# Altium schematic sheet 1_InputPowerProtection.SchDoc
size A4; PageSetup: Record=PageOptions|CenterHorizontal=True|CenterVertical=True|PrintScale=1.00|XCorrection=1.00|YCorrection=1.00|PrintKind=1|BorderSize=5000000|LeftOffset=0|BottomOffset=0|Orientation=2|PaperLength=1000|PaperWidth=1000|Scale=100|PaperSource=7|PrintQuality=-3|MediaType=1|DitherType=10|PrintScaleMode=1|PaperKind=Executive|PaperIndex=7
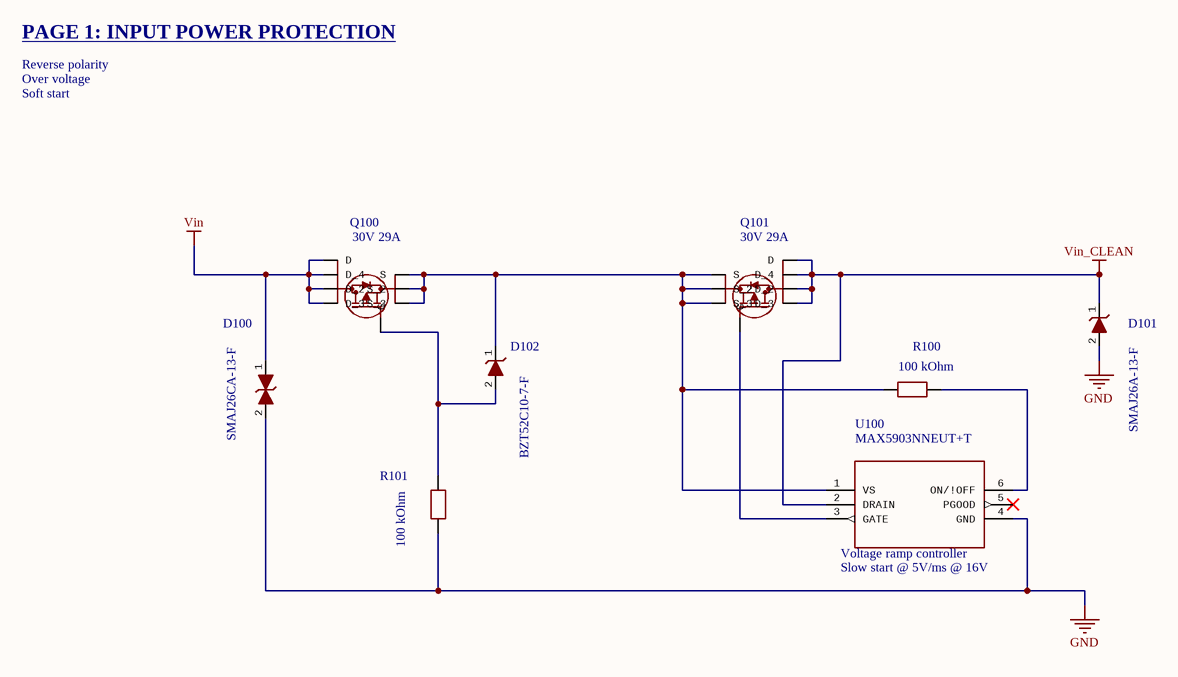
[diagram p0: 1_InputPowerProtection.SchDoc]

## Parts
D100  SMAJ26CA-13-F  [DIODE_DO-214AC]
D101  SMAJ26A-13-F  [DIODE_DO-214AC]
D102  BZT52C10-7-F  [DIODE_SOD-123]
Q100  value 30V 29A  [MOSFET_SOIC-8]  (hidden comment: SI4459ADY)
Q101  value 30V 29A  [MOSFET_SOIC-8]  (hidden comment: SI4459ADY)
R100  value 100 kOhm  [RES_0603]  (hidden comment: ERJ3GEYJ104V)
R101  value 100 kOhm  [RES_0603]  (hidden comment: ERJ3GEYJ104V)
U100  MAX5903NNEUT+T  [HOTSWAP_SOT-6]

## Nets
GND: D100.2 D101.2 R101.1 U100.4(GND)
Vin: D100.1 Q100.5(D_3) Q100.6(D_2) Q100.7(D_4) Q100.8(D)
Vin_CLEAN: D101.1 Q101.5(D_3) Q101.6(D_2) Q101.7(D_4) Q101.8(D) U100.2(DRAIN)
NetD102_1: D102.1 Q100.1(S_3) Q100.2(S_2) Q100.3(S) Q101.1(S_3) Q101.2(S_2) Q101.3(S) R100.1 U100.1(VS)
NetD102_2: D102.2 Q100.4(G) R101.2
NetQ101_4: Q101.4(G) U100.3(GATE)
NetR100_2: R100.2 U100.6(ON/!OFF)

Not connected (* = marked no-connect by the designer): U100 5(PGOOD)*

## Notes on the sheet
- PAGE 1: INPUT POWER PROTECTION
- Reverse polarity
- Over voltage
- Soft start
- (near U100) Voltage ramp controller
- (near U100) Slow start @ 5V/ms @ 16V

## Library data of the parts
D100 = SMAJ26CA-13-F: Diode TVS Bidirectional 26V; Mfr_Name: Diodes Inc; Manufacturer_Part_Number: SMAJ26A-13-F; Value: 26V; Link: https://www.digikey.ca/en/products/detail/diodes-incorporated/SMAJ26A-13-F/806555?s=N4IgTCBcDaIMoFkCCApMA2JBaAYgEQEkAVAJSwDk8QBdAXyA; Package: DO-214AC; PartNumber: SMAJ26CA-13-F; SupplierPartNumber: SMAJ26CA-FDITR-ND; SuppliersPartNumber: C134976
D101 = SMAJ26A-13-F: Diode TVS 26V; Mfr_Name: Diodes Inc; GateName_1: A; DeviceName: SMA_DIO; SymbolName_1: DIODE; LibraryName: 2022-09-06_21-11-13_Library; DeviceSetName: SMAJ26A-13-F; Copyright: Copyright (C) 2022 Ultra Librarian. All rights reserved.; Manufacturer_Part_Number: SMAJ26A-13-F; Digi-Key_Part_Number_1: SMAJ26A-FDICT-ND; Digi-Key_Part_Number_2: SMAJ26A-FDIDKR-ND; Digi-Key_Part_Number_3: SMAJ26A-FDITR-ND; Link: https://www.digikey.ca/en/products/detail/diodes-incorporated/SMAJ26A-13-F/806555?s=N4IgTCBcDaIMoFkCCApMA2JBaAjAZiwDEQBdAXyA; Package: DO-214AC; PartNumber: SMAJ26A-13-F; SupplierPartNumber: SMAJ26A-FDITR-ND; SuppliersPartNumber: C134975
D102 = BZT52C10-7-F: Diode Zener 10V 370mW; Manufacturer_Name: Diodes Inc.; SymbolName_1: BZT52C10-7-F; LibraryName: BZT52C10-7-F; DeviceSetName: BZT52C10-7-F; Manufacturer_Part_Number: BZT52C10-7-F; Mouser_Part_Number: 621-BZT52C10-F; Mouser_Price-Stock: https://www.mouser.co.uk/ProductDetail/Diodes-Incorporated/BZT52C10-7-F?qs=%2F0USrAtie8G0fxvqWmtHrQ%3D%3D; Link: https://www.digikey.ca/en/products/detail/diodes-incorporated/BZT52C10-7-F/717726; Value: 10V 370mW; Package: SOD-123; PartNumber: BZT52C10-7-F; SupplierPartNumber: BZT52C10-FDITR-ND; SuppliersPartNumber: C155227
Q100 Q101 = SI4459ADY-T1-GE3SO_ADY-T1-GE3_VIS-M: P-Channel 30V 29A 5mOHm; Mfr_Name: Vishay; Manufacturer_Part_Number: SI4459ADY-T1-GE3; Link: https://www.digikey.ca/en/products/detail/vishay-siliconix/SI4459ADY-T1-GE3/1978849?s=N4IgTCBcDaIMoEkAsSCsBOAggEQJoFoAVARnwHEBRAZhAF0BfIA; Package: SOIC-8; PartNumber: SI4459ADY-T1-GE3; SupplierNumber: SI4459ADY-T1-GE3TR-ND; SuppliersPartNumber: C143743
R100 R101 = ERJ3GEYJ104V: Res 100kOhm 1/10W 0603; Manufacturer_Name: Panasonic; Link: https://www.digikey.ca/en/products/detail/panasonic-electronic-components/ERJ-3GEYJ104V/135832?s=N4IgTCBcDaIKICUBSBmA4nAmkgjABgBYA1EAXQF8g; Package: 0603; SupplierPartNumber: P100KGTR-ND; SuppliersPartNumber: C278633; PartNumber: ERJ3GEYJ104V
U100 = MAX5903NNEUT+T: Hot Swap Controller MAX5903NNEUT+T; Manufacturer: Analog Devices Inc; DeviceName: 21-0058_U6F+6_MXM-M; DeviceSetName: MAX5903NNEUT+T; Copyright: Copyright (C) 2023 Ultra Librarian. All rights reserved.; PartNumber: MAX5903NNEUT+T; Digi-Key_Part_Number_1: MAX5903NNEUT+T-ND; Digi-Key_Part_Number_2: MAX5903NNEUT+TCT-ND; Digi-Key_Part_Number_3: MAX5903NNEUT+TDKR-ND; Link: https://www.digikey.ca/en/products/detail/analog-devices-inc-maxim-integrated/MAX5903NNEUT-T/1781318?s=N4IgTCBcDaILIEEAaBWAnABgMwDkcFEBVAFQGpiQBdAXyA; SupplierNumber: MAX5903NNEUT+TTR-ND; SuppliersPartNumber: *; Value: *; Package: SOT-23-6